# Altium schematic sheet driver-phase-i-u-measure.SchDoc: Phase driver
size A3; SheetNumber: 20; SheetTotal: 21
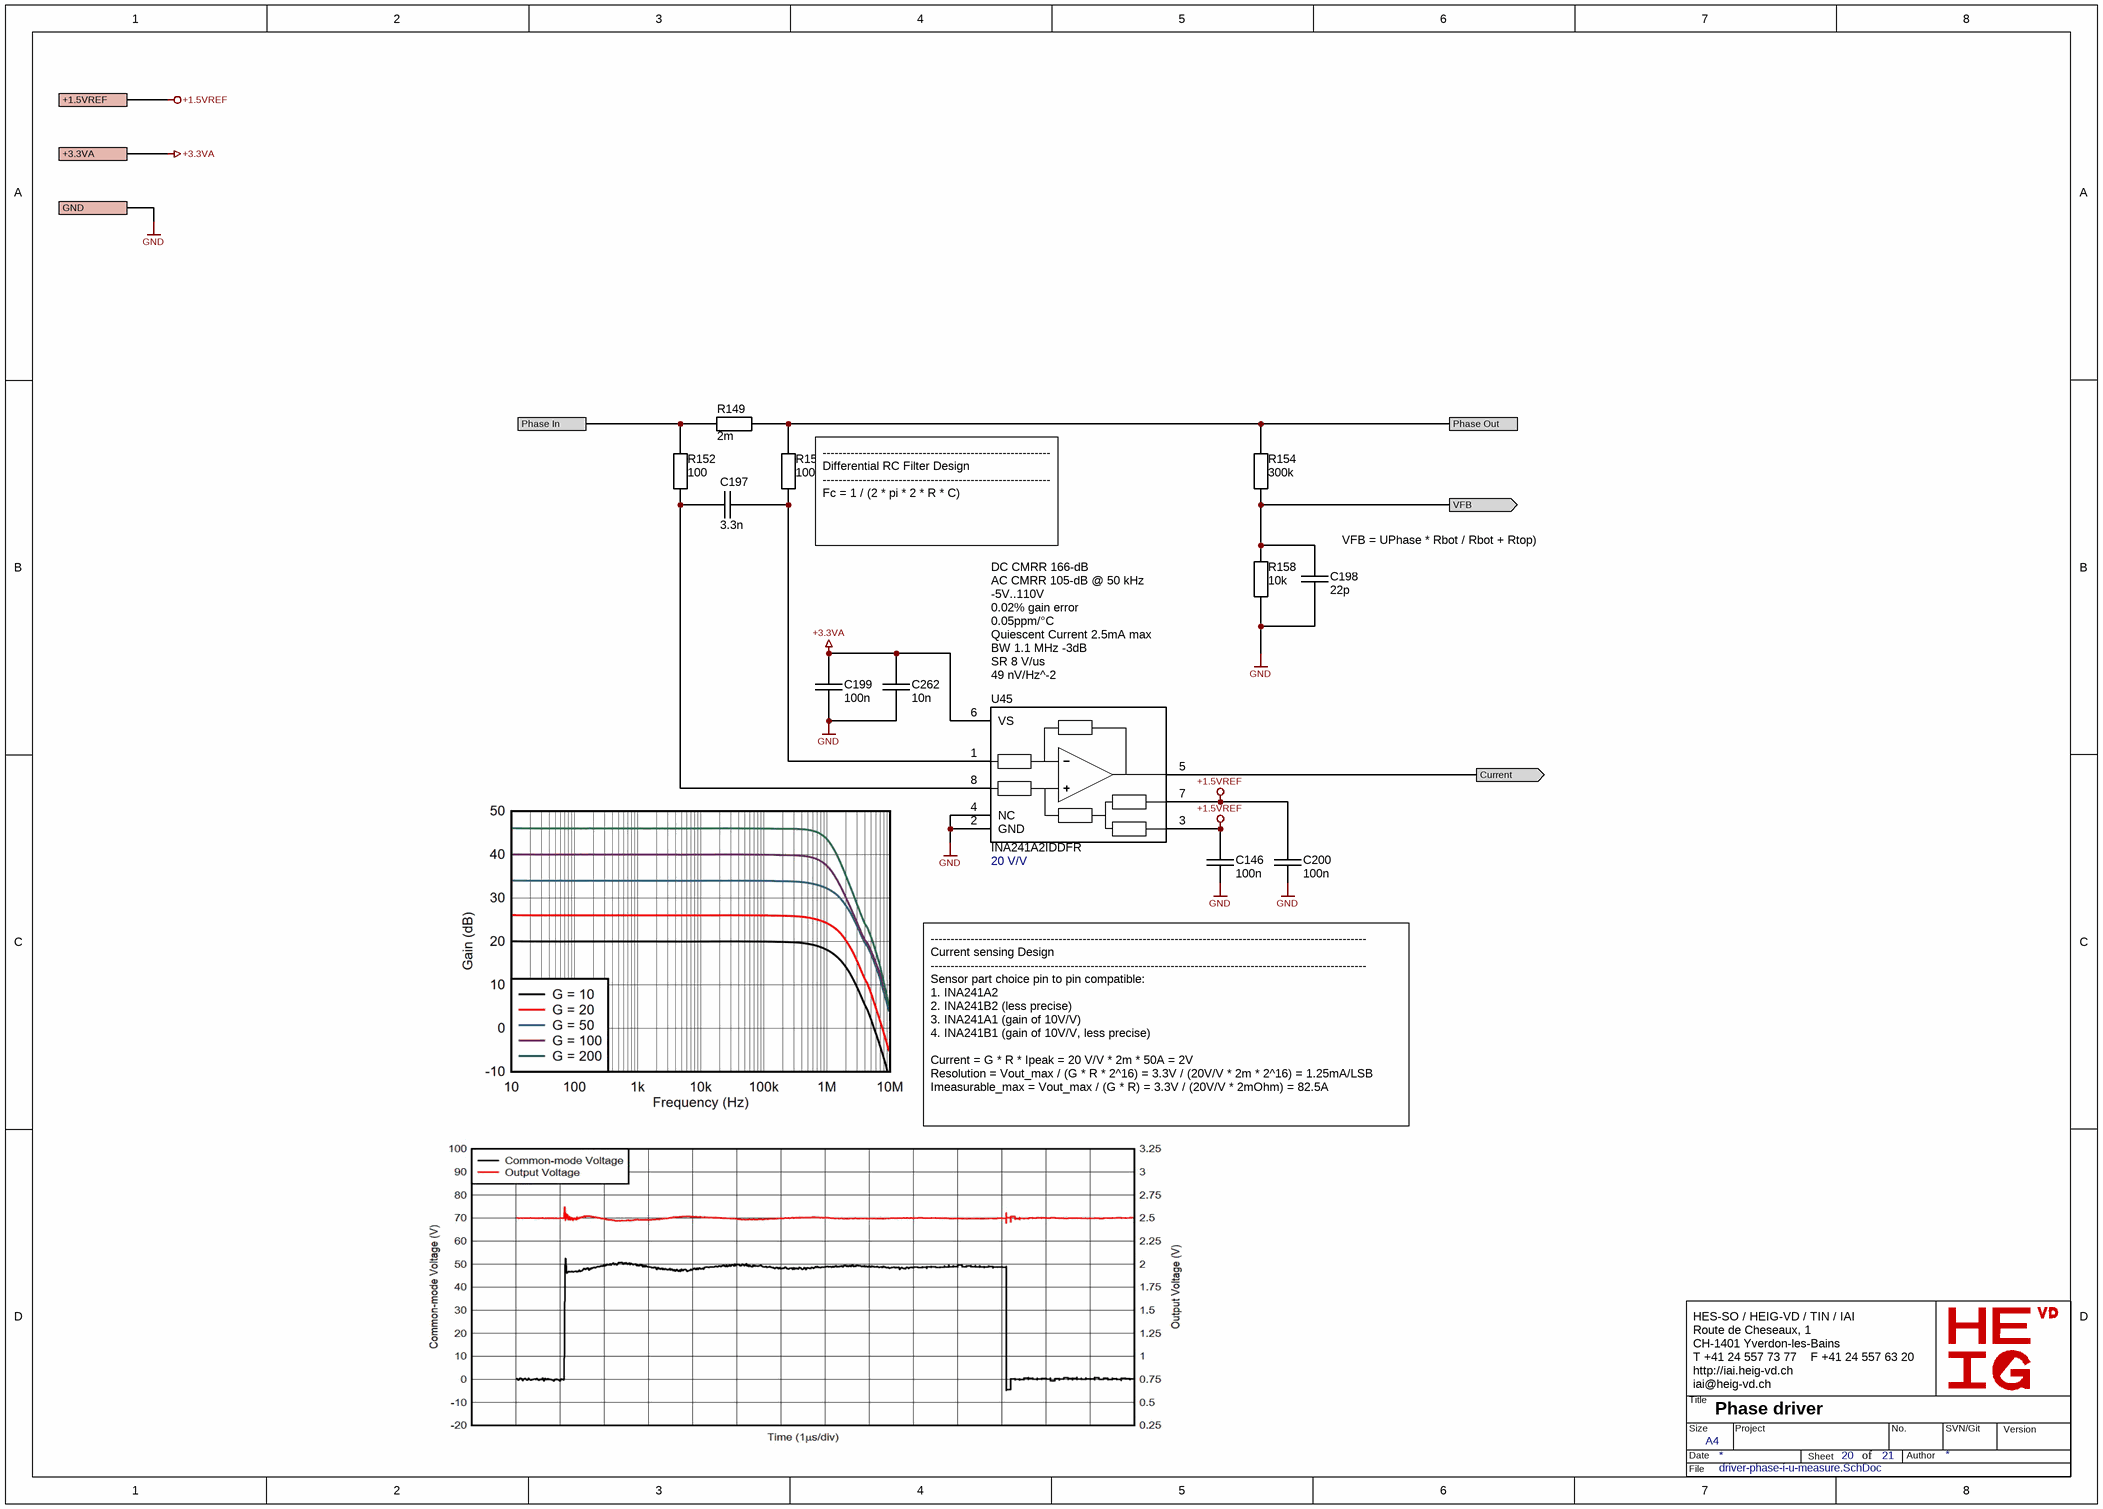
[diagram p0: driver-phase-i-u-measure.SchDoc]

## Parts
C146  100n  [SM/C0402]
C197  3.3n  [SM/C0402]
C198  22p  [SM/C0402]
C199  100n  [SM/C0402]
C200  100n  [SM/C0402]
C262  10n  [SM/C0402]
R149  2m  [SM/R1206]
R152  100  [SM/R0402]
R153  100  [SM/R0402]
R154  300k  [SM/R0402]
R158  10k  [SM/R0402]
U45  INA241A2IDDFR  Gain: 20 V/V  [SOT65P280X110-8N]

## Ports
+1.5VREF, +3.3VA, Current (out), GND, Phase In, Phase Out, VFB (out)

## Nets
+1.5VREF: C146.2 C200.2 U45.3(REF2) U45.7(REF1) ; port +1.5VREF
+3.3VA: C199.2 C262.1 U45.6(VS) ; port +3.3VA
GND: C146.1 C198.1 C199.1 C200.1 C262.2 R158.1 U45.2(GND) U45.4(NC) ; port GND
Current: U45.5(OUT) ; port Current
Phase In: R149.1 R152.2 ; port Phase In
Phase Out: R149.2 R153.2 R154.2 ; port Phase Out
VFB: C198.2 R154.1 R158.2 ; port VFB
NetC197_1: C197.1 R152.1 U45.8(IN+)
NetC197_2: C197.2 R153.1 U45.1(IN-)

## Notes on the sheet
- (near R153) ---------------------------------------------------------
  Differential RC Filter Design
  ---------------------------------------------------------
  Fc = 1 / (2 * pi * 2 * R * C)
- (near C198) VFB = UPhase * Rbot / Rbot + Rtop)
- (near U45) DC CMRR 166-dB
  AC CMRR 105-dB @ 50 kHz
  -5V..110V
  0.02% gain error
  0.05ppm/°C
  Quiescent Current 2.5mA max
  BW 1.1 MHz -3dB
  SR 8 V/us
  49 nV/Hz^-2
- -------------------------------------------------------------------------------------------------------------
  Current sensing Design
  -------------------------------------------------------------------------------------------------------------
  Sensor part choice pin to pin compatible:
  1. INA241A2
  2. INA241B2 (less precise)
  3. INA241A1 (gain of 10V/V)
  4. INA241B1 (gain of 10V/V, less precise)
  Current = G * R * Ipeak = 20 V/V * 2m * 50A = 2V
  Resolution = Vout_max / (G * R * 2^16) = 3.3V / (20V/V * 2m * 2^16) = 1.25mA/LSB
  Imeasurable_max = Vout_max / (G * R) = 3.3V / (20V/V * 2mOhm) = 82.5A
- HES-SO / HEIG-VD / TIN / IAI
  Route de Cheseaux, 1
  CH-1401 Yverdon-les-Bains
  T +41 24 557 73 77    F +41 24 557 63 20
  http://iai.heig-vd.ch
  iai@heig-vd.ch
- Title
- Size
- Date
- A4
- Project
- Sheet
- of
- No.
- Author
- SVN/Git
- Version
- File

## Library data of the parts
C146 C199 C200 = CAP CER 100NF 25V X5R 0402: 100 nF ±10% 25V Ceramic Capacitor X5R 0402 (1005 Metric); Voltage: 25V; Dielectric: X5R; Supplier 1: Digi-Key; Supplier Part Number 1: 1276-1043-1-ND; Value: 100n
C197 = CAP CER 3.3NF 100V X8R 0402: 3.3 nF ±10% 100V Ceramic Capacitor X8R 0402 (1005 Metric); Voltage: 16V; Dielectric: X7R; Supplier 1: Digi-Key; Supplier Part Number 1: 445-15951-1-ND; Value: 3.3n
C198 = CAP CER 22PF 50V C0G/NPO 0402: 22 pF ±2% 50V Ceramic Capacitor C0G, NP0 0402 (1005 Metric); Dielectric: NPO; Voltage: 50V; Supplier 1: Digi-Key; Supplier Part Number 1: 311-1652-1-ND; Value: 22p
C262 = CAP CER 10NF 50V X7R 0402: 10 nF ±10% 50V Ceramic Capacitor X7R 0402 (1005 Metric); Voltage: 50V; Dielectric: X7R; Supplier 1: Digi-Key; Supplier Part Number 1: 1276-1028-1-ND; Value: 10n
R149 = RES 0.002 OHM 1% 1W 1206: 2 mOhms ±1% 1W Chip Resistor 1206 (3216 Metric) Current Sense, Moisture Resistant Metal Element; Supplier 1: Digi-Key; Supplier Part Number 1: CSNL1206FT2L00CT-ND; Value: 2m
R152 R153 = RES 100 OHM 1% 1/16W 0402: 100 Ohms ±1% 0.063W, 1/16W Chip Resistor 0402 (1005 Metric) Moisture Resistant Thick Film; Supplier 1: Digi-Key; Supplier Part Number 1: 13-RC0402FR-13100RLCT-ND; Value: 100
R154 = RES 300K OHM 1% 1/16W 0402: 300 kOhms ±1% 0.063W, 1/16W Chip Resistor 0402 (1005 Metric) Moisture Resistant Thick Film; Value: 300k; Supplier 1: Digi-Key; Supplier Part Number 1: 311-300KLRCT-ND
R158 = RES 10K OHM 1% 1/16W 0402: 10 kOhms ±1% 0.063W, 1/16W Chip Resistor 0402 (1005 Metric) Moisture Resistant Thick Film; Supplier 1: Digi-Key; Supplier Part Number 1: 1276-3431-1-ND; Value: 10k
U45 = INA241A2IDDFR: Current Sense Amplifier 1 Circuit Single-Ended TSOT-23-8; Supplier 1: Digi-Key; Supplier Part Number 1: 296-INA241A2IDDFRDKR-ND